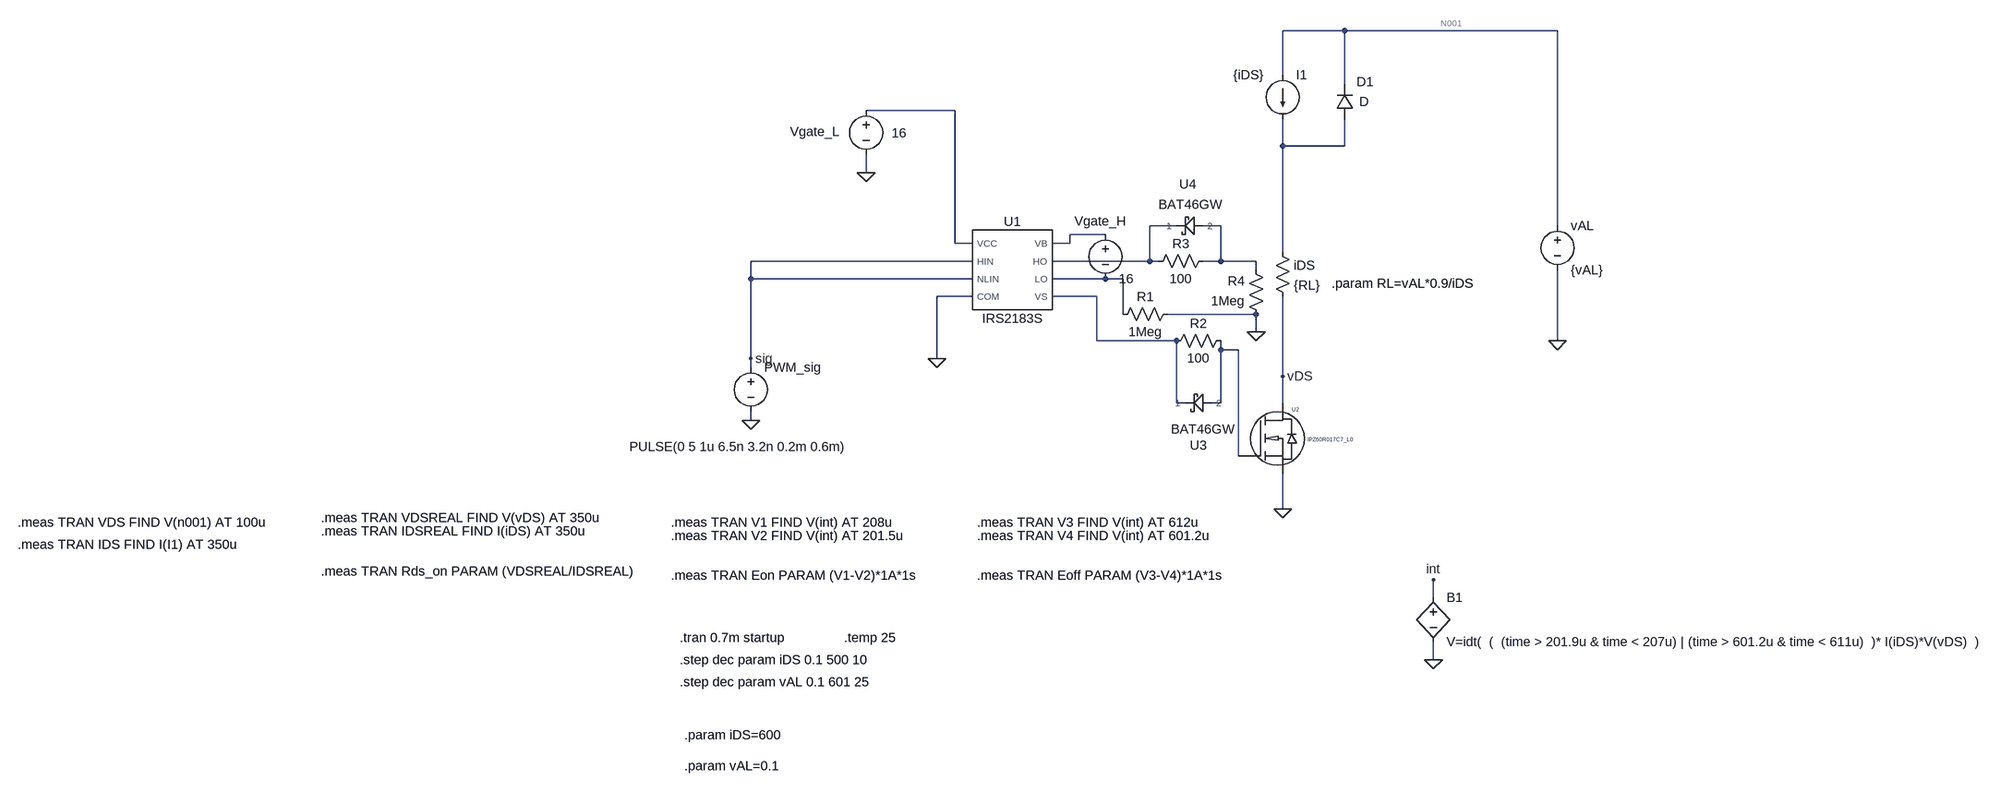
[diagram p0: schematic Eon_Eoff_circuit.asc]
Eon_Eoff_circuit.asc, the LTspice schematic file:
Version 4.1
SHEET 1 2024 1088
WIRE 704 -256 592 -256
WIRE 1088 -256 704 -256
WIRE 592 -176 592 -256
WIRE 704 -160 704 -256
WIRE 0 -112 -160 -112
WIRE 592 -48 592 -96
WIRE 704 -48 704 -96
WIRE 704 -48 592 -48
WIRE -160 0 -160 -32
WIRE 400 96 352 96
WIRE 480 96 448 96
WIRE 1088 96 1088 -256
WIRE 272 112 208 112
WIRE 0 128 0 -112
WIRE 32 128 0 128
WIRE 208 128 208 112
WIRE 208 128 176 128
WIRE 592 144 592 -48
WIRE 32 160 -368 160
WIRE 352 160 352 96
WIRE 352 160 176 160
WIRE 368 160 352 160
WIRE 480 160 480 96
WIRE 480 160 448 160
WIRE 544 160 480 160
WIRE 544 176 544 160
WIRE -368 192 -368 160
WIRE 32 192 -368 192
WIRE 272 192 176 192
WIRE 304 192 272 192
WIRE 32 224 -32 224
WIRE 256 224 176 224
WIRE 304 256 304 192
WIRE 544 256 384 256
WIRE 544 288 544 256
WIRE 256 304 256 224
WIRE 400 304 256 304
WIRE 1088 304 1088 176
WIRE 480 320 480 304
WIRE 512 320 480 320
WIRE -368 336 -368 192
WIRE -32 336 -32 224
WIRE -368 352 -368 336
WIRE 592 368 592 224
WIRE 400 416 400 304
WIRE 416 416 400 416
WIRE 480 416 480 320
WIRE 480 416 464 416
WIRE 592 416 592 368
WIRE -368 448 -368 432
WIRE 512 512 512 320
WIRE 592 608 592 544
WIRE 864 768 864 736
WIRE 864 880 864 848
FLAG -160 0 0
FLAG -368 448 0
FLAG -32 336 0
FLAG -368 336 sig
FLAG 1088 304 0
FLAG 864 880 0
FLAG 864 736 int
FLAG 592 608 0
FLAG 544 288 0
FLAG 592 368 vDS
SYMBOL voltage -368 336 R0
WINDOW 3 -219 159 Left 2
WINDOW 123 0 0 Left 0
WINDOW 39 0 0 Left 0
SYMATTR Value PULSE(0 5 1u 6.5n 3.2n 0.2m 0.6m)
SYMATTR InstName PWM_sig
SYMBOL voltage -160 -128 R0
WINDOW 123 0 0 Left 0
WINDOW 39 0 0 Left 0
WINDOW 0 -137 54 Left 2
WINDOW 3 46 57 Left 2
SYMATTR InstName Vgate_L
SYMATTR Value 16
SYMBOL IRS2183S 96 176 R0
SYMATTR InstName U1
SYMBOL voltage 1088 80 R0
WINDOW 123 0 0 Left 0
WINDOW 39 0 0 Left 0
SYMATTR InstName vAL
SYMATTR Value {vAL}
SYMBOL res 496 288 R90
WINDOW 0 0 56 VBottom 2
WINDOW 3 32 56 VTop 2
SYMATTR InstName R2
SYMATTR Value 100
SYMBOL res 464 144 R90
WINDOW 0 0 56 VBottom 2
WINDOW 3 32 56 VTop 2
SYMATTR InstName R3
SYMATTR Value 100
SYMBOL voltage 272 96 R0
WINDOW 123 0 0 Left 0
WINDOW 39 0 0 Left 0
WINDOW 0 -56 -8 Left 2
SYMATTR InstName Vgate_H
SYMATTR Value 16
SYMBOL bv 864 752 R0
SYMATTR InstName B1
SYMATTR Value V=idt(  (  (time > 201.9u & time < 207u) | (time > 601.2u & time < 611u)  )* I(iDS)*V(vDS)  )
SYMBOL IPx6xx_L1 512 512 R0
SYMATTR InstName U2
SYMATTR Value IPZ60R017C7_L0
SYMBOL BAT46GW 448 416 R0
WINDOW 0 -8 92 Bottom 2
SYMATTR InstName U3
SYMBOL BAT46GW 432 96 R0
WINDOW 0 -11 -59 Bottom 2
WINDOW 3 -7 -54 Top 2
SYMATTR InstName U4
SYMBOL res 400 240 R90
WINDOW 0 0 56 VBottom 2
WINDOW 3 32 56 VTop 2
SYMATTR InstName R1
SYMATTR Value 1Meg
SYMBOL res 576 128 R0
SYMATTR InstName iDS
SYMATTR Value {RL}
SYMBOL res 560 272 R180
WINDOW 0 36 76 Left 2
WINDOW 3 36 40 Left 2
SYMATTR InstName R4
SYMATTR Value 1Meg
SYMBOL current 592 -176 R0
WINDOW 3 -89 0 Left 2
SYMATTR Value {iDS}
SYMATTR InstName I1
SYMBOL diode 720 -96 R180
WINDOW 0 -36 68 Left 2
WINDOW 3 -28 32 Left 2
SYMATTR InstName D1
TEXT -496 840 Left 2 !.tran 0.7m startup
TEXT -512 728 Left 2 !.meas TRAN Eon PARAM (V1-V2)*1A*1s
TEXT -512 632 Left 2 !.meas TRAN V1 FIND V(int) AT 208u
TEXT -512 656 Left 2 !.meas TRAN V2 FIND V(int) AT 201.5u
TEXT 40 632 Left 2 !.meas TRAN V3 FIND V(int) AT 612u
TEXT 40 656 Left 2 !.meas TRAN V4 FIND V(int) AT 601.2u
TEXT 40 728 Left 2 !.meas TRAN Eoff PARAM (V3-V4)*1A*1s
TEXT -496 880 Left 2 !.step dec param iDS 0.1 500 10
TEXT -496 920 Left 2 !.step dec param vAL 0.1 601 25
TEXT -488 1016 Left 2 !.param iDS=600
TEXT -488 1072 Left 2 !.param vAL=0.1
TEXT 680 200 Left 2 !.param RL=vAL*0.9/iDS
TEXT -1144 648 Left 2 !.meas TRAN IDSREAL FIND I(iDS) AT 350u
TEXT -1144 624 Left 2 !.meas TRAN VDSREAL FIND V(vDS) AT 350u
TEXT -1144 720 Left 2 !.meas TRAN Rds_on PARAM (VDSREAL/IDSREAL)
TEXT -1728 632 Left 2 !.meas TRAN VDS FIND V(n001) AT 100u
TEXT -1728 672 Left 2 !.meas TRAN IDS FIND I(I1) AT 350u
TEXT -200 840 Left 2 !.temp 25

The netlist it stands for:
* Eon_Eoff_circuit.asc
V§PWM_sig sig 0 PULSE(0 5 1u 6.5n 3.2n 0.2m 0.6m)
Vgate_L N002 0 16
X§U1 N007 N004 0 sig sig N002 N006 N008 IRS2183S  ; pins LO HO COM HIN NLIN VCC VB VS
vAL N001 0 {vAL}
R2 N009 N008 100
R3 N005 N004 100
Vgate_H N006 N007 16
B1 int 0 V=idt(  (  (time > 201.9u & time < 207u) | (time > 601.2u & time < 611u)  )* I(iDS)*V(vDS)  )
X§U2 vDS N009 0 IPZ60R017C7_L0  ; pins drain gate source
X§U3 N008 N009 BAT46GW  ; pins 1 2
X§U4 N004 N005 BAT46GW  ; pins 1 2
R1 0 N007 1Meg
R§iDS N003 vDS {RL}
R4 0 N005 1Meg
I1 N001 N003 {iDS}
D1 N003 N001 D
.model D D
.lib standard.dio
.tran 0.7m startup
.meas TRAN Eon PARAM (V1-V2)*1A*1s
.meas TRAN V1 FIND V(int) AT 208u
.meas TRAN V2 FIND V(int) AT 201.5u
.meas TRAN V3 FIND V(int) AT 612u
.meas TRAN V4 FIND V(int) AT 601.2u
.meas TRAN Eoff PARAM (V3-V4)*1A*1s
.step dec param iDS 0.1 500 10
.step dec param vAL 0.1 601 25
.param iDS=600
.param vAL=0.1
.param RL=vAL*0.9/iDS
.meas TRAN IDSREAL FIND I(iDS) AT 350u
.meas TRAN VDSREAL FIND V(vDS) AT 350u
.meas TRAN Rds_on PARAM (VDSREAL/IDSREAL)
.meas TRAN VDS FIND V(n001) AT 100u
.meas TRAN IDS FIND I(I1) AT 350u
.temp 25
.lib IRS2183S.lib
.lib Infineon_SimulationModel_CoolMOS_C7_MOSFET_600V_Spice.lib
.lib BAT46GW.lib
.backanno
.end